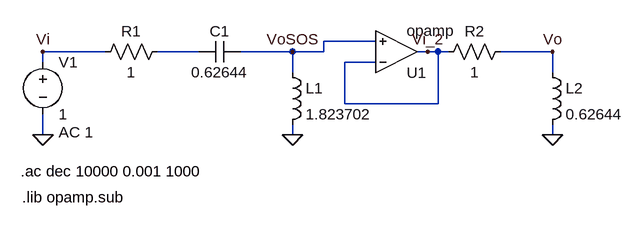
[diagram p0: schematic ts2_hpf_cheby_norm.asc]
ts2_hpf_cheby_norm.asc, the LTspice schematic file:
Version 4
SHEET 1 880 680
WIRE 432 96 352 96
WIRE 16 112 -80 112
WIRE 160 112 96 112
WIRE 304 112 224 112
WIRE 352 112 352 96
WIRE 352 112 304 112
WIRE 512 112 496 112
WIRE 528 112 512 112
WIRE 544 112 528 112
WIRE 704 112 624 112
WIRE -80 128 -80 112
WIRE 432 128 384 128
WIRE 304 144 304 112
WIRE 704 144 704 112
WIRE 384 192 384 128
WIRE 528 192 528 112
WIRE 528 192 384 192
WIRE -80 240 -80 208
WIRE 304 240 304 224
WIRE 704 240 704 224
FLAG 704 240 0
FLAG 304 240 0
FLAG -80 240 0
FLAG 704 112 Vo
FLAG -80 112 Vi
FLAG 304 112 VoSOS
FLAG 512 112 Vi_2
SYMBOL res 112 96 R90
WINDOW 0 0 56 VBottom 2
WINDOW 3 32 56 VTop 2
SYMATTR InstName R1
SYMATTR Value 1
SYMBOL cap 224 96 R90
WINDOW 0 0 32 VBottom 2
WINDOW 3 32 32 VTop 2
SYMATTR InstName C1
SYMATTR Value 0.62644
SYMBOL ind 288 128 R0
SYMATTR InstName L1
SYMATTR Value 1.823702
SYMBOL ind 688 128 R0
SYMATTR InstName L2
SYMATTR Value 0.62644
SYMBOL res 640 96 R90
WINDOW 0 0 56 VBottom 2
WINDOW 3 32 56 VTop 2
SYMATTR InstName R2
SYMATTR Value 1
SYMBOL Opamps\\opamp 464 176 M180
SYMATTR InstName U1
SYMBOL voltage -80 112 R0
WINDOW 123 24 124 Left 2
WINDOW 39 0 0 Left 0
SYMATTR InstName V1
SYMATTR Value 1
SYMATTR Value2 AC 1
TEXT -114 296 Left 2 !.ac dec 10000 0.001 1000
TEXT -112 336 Left 2 !.lib opamp.sub

The netlist it stands for:
* ts2_hpf_cheby_norm.asc
R1 N001 Vi 1
C1 VoSOS N001 0.62644
L1 VoSOS 0 1.823702
L2 Vo 0 0.62644
R2 Vo Vi_2 1
XU1 Vi_2 VoSOS Vi_2 opamp Aol=100K GBW=10Meg  ; pins invin noninvin out
V1 Vi 0 1 AC 1
.ac dec 10000 0.001 1000
.lib opamp.sub
.backanno
.end